# Altium schematic sheet 05_SENSORS.SchDoc
size A
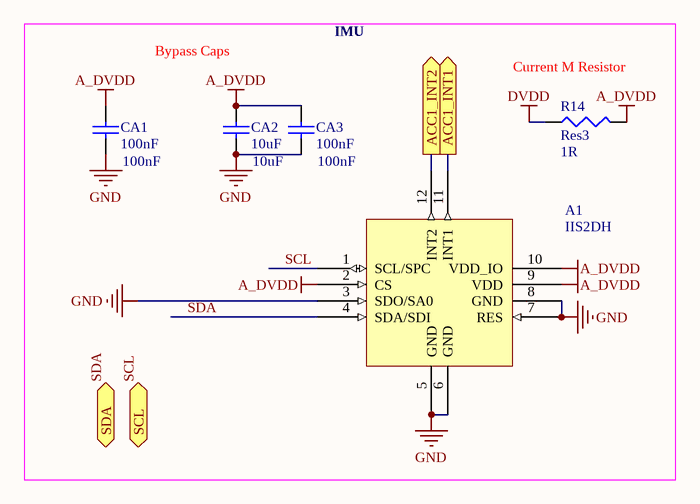
[diagram p0: 05_SENSORS.SchDoc]

## Parts
A1  IIS2DH  [*LGA12R50P4X4_200X200X86]
CA1  100nF  [0402]
CA2  10uF  [0402]
CA3  100nF  [0402]
R14  Res3  value 1R  [0402]

## Blocks framed on the sheet
IMU: A1 CA1-CA3 R14

## Ports
ACC1_INT1 (out), ACC1_INT2 (out), SCL (bidir), SDA (bidir)

## Nets
A_DVDD: A1.2(CS) A1.9(VDD) A1.10(VDD_IO) CA1.2 CA2.2 CA3.2 R14.2
DVDD: R14.1
GND: A1.3(SDO/SA0) A1.5(GND) A1.6(GND) A1.7(RES) A1.8(GND) CA1.1 CA2.1 CA3.1
ACC1_INT1: A1.11(INT1) ; port ACC1_INT1
ACC1_INT2: A1.12(INT2) ; port ACC1_INT2
SCL: A1.1(SCL/SPC) ; port SCL
SDA: A1.4(SDA/SDI) ; port SDA

## Notes on the sheet
- Bypass Caps
- (near R14) Current M Resistor

## Library data of the parts
CA1-CA3 = Cap Semi: Capacitor (Semiconductor SIM Model); Published: 8-Jun-2000; LatestRevisionDate: 29-May-2009; LatestRevisionNote: IPC-7351 Footprint Added.; PackageReference: C1206; Publisher: Altium Limited; PackageDescription: Chip Capacitor
  CA1 CA3: Value: 100nF
  CA2: Value: 10uF
R14 = Res3: Resistor; Published: 8-Jun-2000; LatestRevisionDate: 29-May-2009; LatestRevisionNote: IPC-7351 Footprint Added.; PackageReference: J1-0603; Publisher: Altium Limited; PackageDescription: Chip Resistor